# Altium schematic sheet MCU.SchDoc
size A4
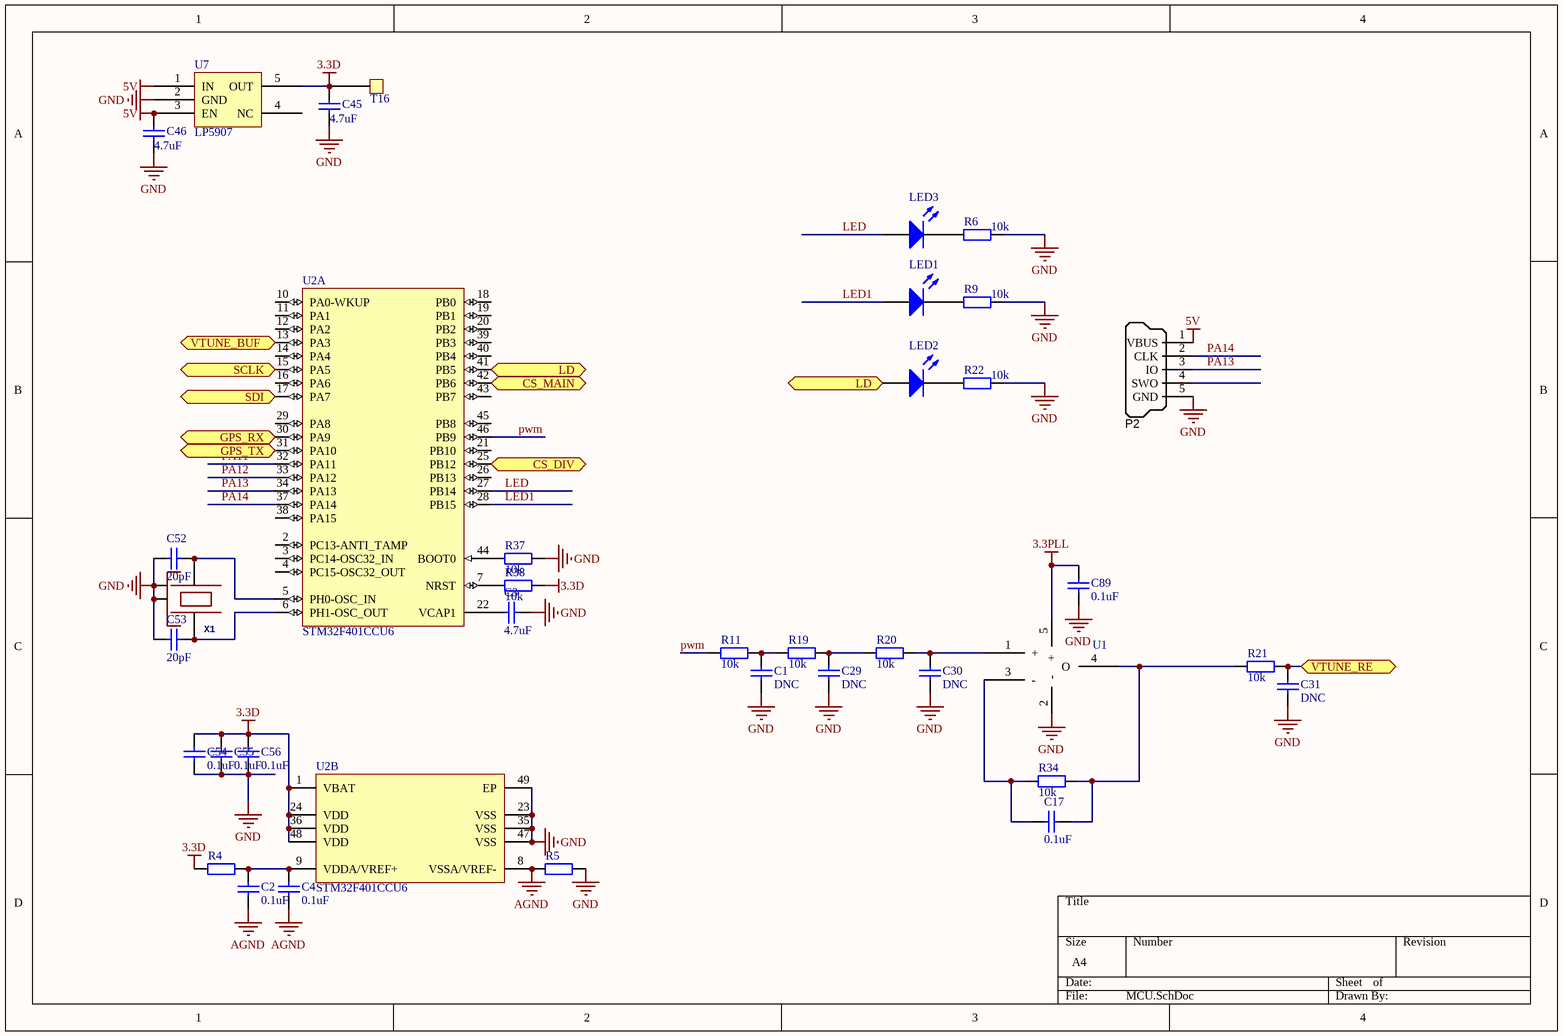
[diagram p0: MCU.SchDoc]

## Parts
C1  value DNC  [0402]  (hidden comment: Cap)
C2  value 0.1uF  [0402]  (hidden comment: Cap)
C3  value 4.7uF  [0603]  (hidden comment: Cap)
C4  value 0.1uF  [0402]  (hidden comment: Cap)
C17  value 0.1uF  [0402]  (hidden comment: Cap)
C29  value DNC  [0402]  (hidden comment: Cap)
C30  value DNC  [0402]  (hidden comment: Cap)
C31  value DNC  [0402]  (hidden comment: Cap)
C45  4.7uF  [0603]
C46  4.7uF  [0603]
C52  value 20pF  [0402]  (hidden comment: Cap)
C53  value 20pF  [0402]  (hidden comment: Cap)
C54  value 0.1uF  [0402]  (hidden comment: Cap)
C55  value 0.1uF  [0402]  (hidden comment: Cap)
C56  value 0.1uF  [0402]  (hidden comment: Cap)
C89  value 0.1uF  [0402]  (hidden comment: Cap)
LED1  LED0  [0603]  (value not drawn)
LED2  LED0  [0603]  (value not drawn)
LED3  LED0  [0603]  (value not drawn)
P2  SWD_MicroUSB  [MICRO-YZX]  (value not drawn)
R4  0R/FB  [0402]  (value not drawn)
R5  0R/FB  [0402]  (value not drawn)
R6  10k  [0402]
R9  10k  [0402]
R11  value 10k  [0402]  (hidden comment: Res2)
R19  value 10k  [0402]  (hidden comment: Res2)
R20  value 10k  [0402]  (hidden comment: Res2)
R21  value 10k  [0402]  (hidden comment: Res2)
R22  10k  [0402]
R34  value 10k  [0402]  (hidden comment: Res2)
R37  value 10k  [0402]  (hidden comment: Res2)
R38  value 10k  [0402]  (hidden comment: Res2)
T16  TestPad  [TestPad - 1mm]  (value not drawn)
U1  OP-SOT23  [SOT23-5]  (value not drawn)
U2  STM32F401CCU6  [STM-UFQFPN48_N]  (parts A,B of 2)
U7  LP5907  [SOT23-5]
X1  24.000 KHz 3.2x2.5mm 8-10pf  [OSCILLATOR-3.2X2.5]  (value not drawn)

## Ports
CS_DIV, CS_MAIN, GPS_RX, GPS_TX, LD, SCLK, SDI, VTUNE_BUF, VTUNE_RE

## Nets
3.3D: C45.2 C54.2 C55.2 C56.2 R4.2 R38.1 T16.1 U2.1(VBAT) U2.24(VDD) U2.36(VDD) U2.48(VDD) U7.5(OUT)
3.3PLL: C89.2 U1.5(+)
5V: C46.2 P2.1(VBUS) U7.1(IN) U7.3(EN)
AGND: C2.1 C4.1 R5.2 U2.8(VSSA/VREF-)
GND: C1.2 C3.1 C29.2 C30.2 C31.2 C45.1 C46.1 C52.1 C53.1 C54.1 C55.1 C56.1 C89.1 P2.5(GND) R5.1 R6.2 R9.2 R22.2 R37.2 U1.2(-) U2.23(VSS) U2.35(VSS) U2.47(VSS) U2.49(EP) U7.2(GND) X1.2(NC_2) X1.4(NC_4)
CS_DIV: U2.25(PB12) ; port CS_DIV
CS_MAIN: U2.42(PB6) ; port CS_MAIN
GPS_RX: U2.30(PA9) ; port GPS_RX
GPS_TX: U2.31(PA10) ; port GPS_TX
LD: LED2.1(A) U2.41(PB5) ; port LD
LED: LED3.1(A) U2.27(PB14)
LED1: LED1.1(A) U2.28(PB15)
PA11: U2.32(PA11)
PA12: U2.33(PA12)
PA13: P2.3(IO) U2.34(PA13)
PA14: P2.2(CLK) U2.37(PA14)
pwm: R11.2 U2.46(PB9)
SCLK: U2.15(PA5) ; port SCLK
SDI: U2.17(PA7) ; port SDI
VTUNE_BUF: U2.13(PA3) ; port VTUNE_BUF
VTUNE_RE: C31.1 R21.1 ; port VTUNE_RE
NetC1_1: C1.1 R11.1 R19.2
NetC2_2: C2.2 C4.2 R4.1 U2.9(VDDA/VREF+)
NetC3_2: C3.2 U2.22(VCAP1)
NetC17_1: C17.1 R34.2 U1.3(-)
NetC17_2: C17.2 R21.2 R34.1 U1.4(O)
NetC29_1: C29.1 R19.1 R20.2
NetC30_1: C30.1 R20.1 U1.1(+)
NetC52_2: C52.2 U2.5(PH0-OSC_IN) X1.1
NetC53_2: C53.2 U2.6(PH1-OSC_OUT) X1.3
NetLED1_2: LED1.2(K) R9.1
NetLED2_2: LED2.2(K) R22.1
NetLED3_2: LED3.2(K) R6.1
NetR37_1: R37.1 U2.44(BOOT0)
NetR38_2: R38.2 U2.7(NRST)

Not connected (* = marked no-connect by the designer): P2 4(SWO); U2 2(PC13-ANTI_TAMP) 3(PC14-OSC32_IN) 4(PC15-OSC32_OUT) 10(PA0-WKUP) 11(PA1) 12(PA2) 14(PA4) 16(PA6) 18(PB0) 19(PB1) 20(PB2) 21(PB10) 26(PB13) 29(PA8) 38(PA15) 39(PB3) 40(PB4) 43(PB7) 45(PB8); U7 4(NC)

## Library data of the parts
C1-C4 C17 C29-C31 C45 C46 C52-C56 C89 = Cap: Capacitor; Published: 8-Jun-2000; LatestRevisionDate: 17-Jul-2002; LatestRevisionNote: Re-released for DXP Platform.; PackageReference: RAD-0.3; Publisher: Altium Limited; PackageDescription: Radial Cap, Thru-Hole; 2 Leads; 0.3 in Pin Spacing
LED1-LED3 = LED0: Typical INFRARED GaAs LED; Published: 8-Jun-2000; LatestRevisionDate: 08-Jul-2005; LatestRevisionNote: Mech Layer 1 removed.; PackageReference: LED-0; Publisher: Altium Limited; PackageDescription: LED; 2 Leads
P2 = SWD_MicroUSB: Connector SMD USB Micro Type B middle mount; Manufacturer 1: Molex Inc; SCDType: undef; Package / Case: SMD; Supplier 1: Digi-Key; Supplier Part Number 1: WM17142CT-ND
R4 R5 R11 R19-R21 R34 R37 R38 = Res2: Resistor; Published: 8-Jun-2000; LatestRevisionDate: 17-Jul-2002; LatestRevisionNote: Re-released for DXP Platform.; PackageReference: AXIAL-0.4; Publisher: Altium Limited; PackageDescription: Axial Device, Thru-Hole; 2 Leads; 0.4 in Pin Spacing
R6 R9 R22 = Res2: Resistor; Value: 0Ohm; Published: 8-Jun-2000; LatestRevisionDate: 17-Jul-2002; LatestRevisionNote: Re-released for DXP Platform.; PackageReference: AXIAL-0.4; Publisher: Altium Limited; PackageDescription: Axial Device, Thru-Hole; 2 Leads; 0.4 in Pin Spacing
U2 = STM32F401CCU6: ARM Cortex-M4 32-bit MCU+FPU, 105 DMIPS, 256 kB Flash, 64 kB Internal RAM, 36 I/Os, 48-pin UFQFPN, -40 to 85 degC, Tray; Manufacturer: STMicroelectronics; FLASH Size (Prog) (kB): 256; I/Os (High Current): 36; Internal RAM Size (kB): 64; Operating Frequency(F) (Processor speed) (MHz): 84; Supply Voltage(Vcc) max (V): 3.6; Supply Voltage(Vcc) min (V): 1.8; DatasheetVersion: Rev. 1; PackageVersion: Rev. 1, 04/2013; PackageReference: UFQFPN48; PackageDescription: 48-Pin Ultra Thin Fine Pitch Quad Flat No-Lead, 7 x 7 x 0.6 mm Body, 0.5 mm Pitch, Exposed Pad; Supplier 1: Newark; Supplier Part Number 1: 19X6217; Supplier 2: Mouser; Supplier Part Number 2: 511-STM32F401CCU6; Core: ARM Cortex-M4; Packing: Tray; Mounting Technology: Surface Mount; PartNumber: STM32F401CCU6; ComponentLink1Description: Manufacturer URL; ComponentLink1URL: http://www.st.com/web/en/home.html; ComponentLink2Description: Datasheet; ComponentLink2URL: http://www.st.com/st-web-ui/static/active/en/resource/technical/document/data_brief/DM00071938.pdf; ComponentLink3Description: Package Specification; ComponentLink3URL: http://www.st.com/st-web-ui/static/active/en/resource/technical/document/data_brief/DM00071938.pdf
X1 = OSCILLATOR-3.2X2.5: Crystal Oscillator in 3.2x2.5 SMD